# EAGLE design weather station shield (EAGLE 8.7.1)
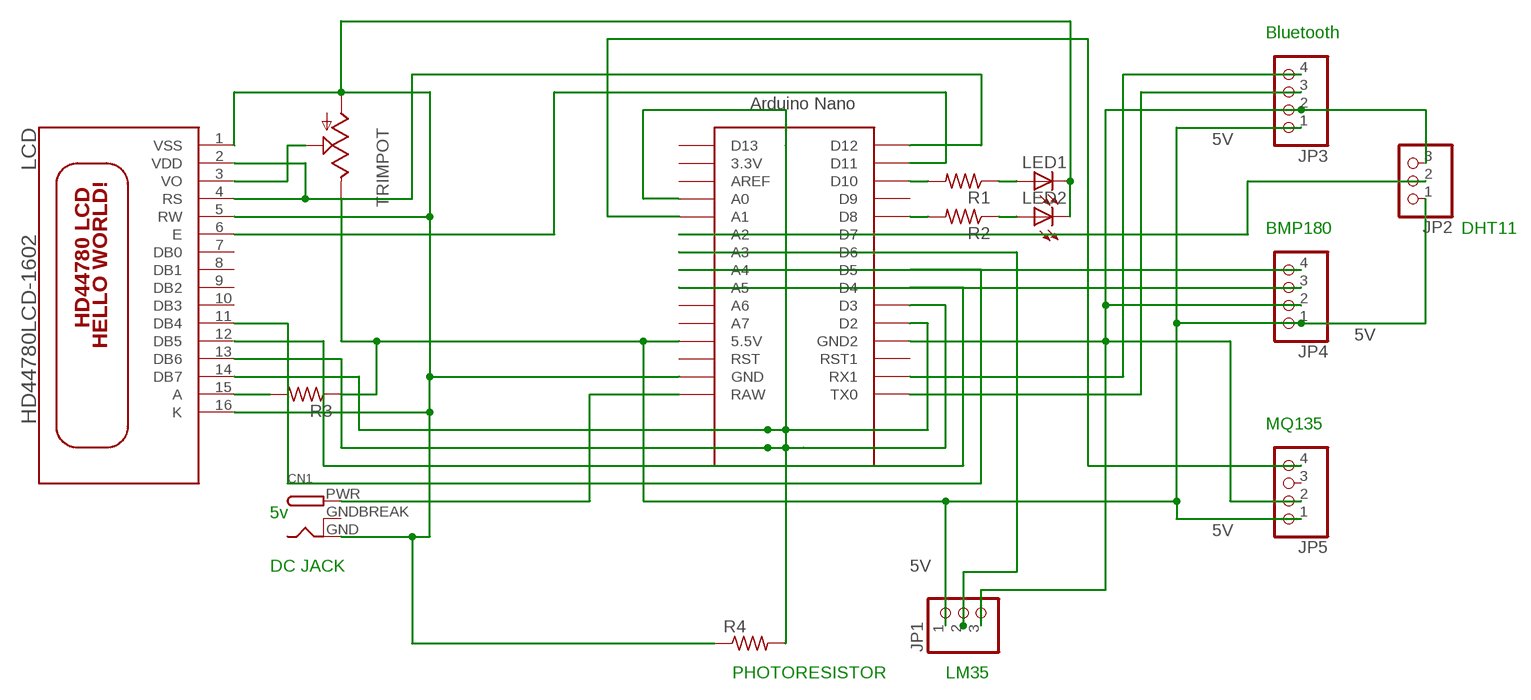
[diagram p0: schematic, sheet 1]

## Parts
CN1  DCBARRELPTH  [DCJACK_2MM_PTH]
JP1  PINHD-1X3  [1X03]
JP2  PINHD-1X3  [1X03]
JP3  PINHD-1X4  [1X04]
JP4  PINHD-1X4  [1X04]
JP5  PINHD-1X4  [1X04]
LCD  HD44780LCD-1602  [LCD1602]
LED1  LED5MM  [LED5MM]
LED2  LED5MM  [LED5MM]
R1  R-US_0204/7  [0204/7]
R2  R-US_0204/7  [0204/7]
R3  R-US_0204/7  [0204/7]
R4  R-US_0204/7  [0204/7]
TRIMPOT  TRIM_US-CA6V  [CA6V]
U$1  NANO  [NANO]

## Nets
5V: JP1.1 JP2.1 JP3.1 JP4.1 JP5.1 R3.1 TRIMPOT.E U$1.5V(5.5V)
N$1: LCD.13(DB6) U$1.D3 U$1.ICSP1 U$1.ICSP3 U$1.ICSP5
N$2: LCD.12(DB5) U$1.D4
N$3: LCD.3(VO) TRIMPOT.S
N$4: JP2.2 U$1.A2
N$5: LCD.6(E) U$1.D11
N$6: LCD.15(A) R3.2
N$7: LCD.11(DB4) U$1.D5
N$8: JP3.4 U$1.RX1
N$9: JP3.3 U$1.TX0
N$10: JP4.4 U$1.A4
N$11: JP4.3 U$1.A5
N$12: R1.2 U$1.D10
N$13: LED1.A R1.1
N$14: R2.2 U$1.D8
N$15: LED2.A R2.1
N$16: R4.2 U$1.A0
N$17: JP1.3 JP2.3 JP3.2 JP4.2 JP5.2 U$1.GND1(GND2)
N$18: JP5.4 U$1.A1
N$19: LCD.14(DB7) U$1.D2 U$1.ICSP2 U$1.ICSP4 U$1.ICSP6
N$22: JP1.2 U$1.A3
N$23: CN1.PWR U$1.RAW
VDD: LCD.2(VDD) LCD.4(RS) U$1.D12
VSS: CN1.GND LCD.1(VSS) LCD.5(RW) LCD.16(K) LED1.K(C) LED2.K(C) R4.1 TRIMPOT.A U$1.GND
Unconnected: JP5.3 LCD.7(DB0) LCD.8(DB1) LCD.9(DB2) LCD.10(DB3) U$1.3.3V U$1.A6 U$1.A7 U$1.AREF U$1.D6 U$1.D7 U$1.D9 U$1.D13 U$1.RST U$1.RST1

## Notes on the sheet
- Bluetooth
- BMP180 | DHT11
- MQ135
- 5v
- DC JACK
- PHOTORESISTOR | LM35

## Power pins joined to a net without a drawn wire
GNDBREAK: CN1.GNDBREAK

## Library data of the parts
CN1 = adafruit:DCBARREL: 2.0mm DC Barrel Jack DCJACK_2MM_PTH - Through Hole Jack (4UConnector: 05537)
JP1 JP2 = pinhead:PINHD-1X3: PIN HEADER
JP3-JP5 = pinhead:PINHD-1X4: PIN HEADER
LCD = adafruit:HD44780LCD: HD44780 LCD Standard character type LCDs, available in sizes from 8x1 to 40x4!
LED1 LED2 = adafruit:LED: LED OSRAM: - CHIPLED LG R971, LG N971, LY N971, LG Q971, LY Q971, LO R971, LY R971 LH N974, LH R974 LS Q976, LO Q976, LY Q976 LO Q996 - Hyper CHIPLED LW Q18S LB Q993, LB Q99A, LB R99A - SideLED LS A670, LO A670, LY A670, LG A670, LP A670 LB A673, LV A673, LT A673, LW A673 LH A674 LY A675 LS A676, LA A676, LO A676, LY A676, LW A676 LS A679, LY A679, LG A679 - Hyper Micro SIDELED® LS Y876, LA Y876, LO Y876, LY Y876 LT Y87S - SmartLED LW L88C, LW L88S LB L89C, LB L89S, LG L890 LS L89K, LO L89K, LY L89K LS L896, LA L896, LO L896, LY L896 - TOPLED LS T670, LO T670, LY T670, LG T670, LP T670 LSG T670, LSP T670, LSY T670, LOP T670, LYG T670 LG T671, LOG T671, LSG T671 LB T673, LV T673, LT T673, LW T673 LH T674 LS T676, LA T676, LO T676, LY T676, LB T676, LH T676, LSB T676, LW T676 LB T67C, LV T67C, LT T67C, LS T67K, LO T67K, LY T67K, LW E67C LS E67B, LA E67B, LO E67B, LY E67B, LB E67C, LV E67C, LT E67C LW T67C LS T679, LY T679, LG T679 LS T770, LO T770, LY T770, LG T770, LP T770 LB T773, LV T773, LT T773, LW T773 LH T774 LS E675, LA E675, LY E675, LS T675 LS T776, LA T776, LO T776, LY T776, LB T776 LHGB T686 LT T68C, LB T68C - Hyper Mini TOPLED® LB M676 - Mini TOPLED Santana® LG M470 LS M47K, LO M47K, LY M47K Source: http://www.osram.convergy.de/
R1-R4 = adafruit:R-US_: RESISTOR, American symbol
TRIMPOT = pot:TRIM_US-: POTENTIOMETER
U$1 = Arduino-clone:NANO: Arduino Nano

## Board
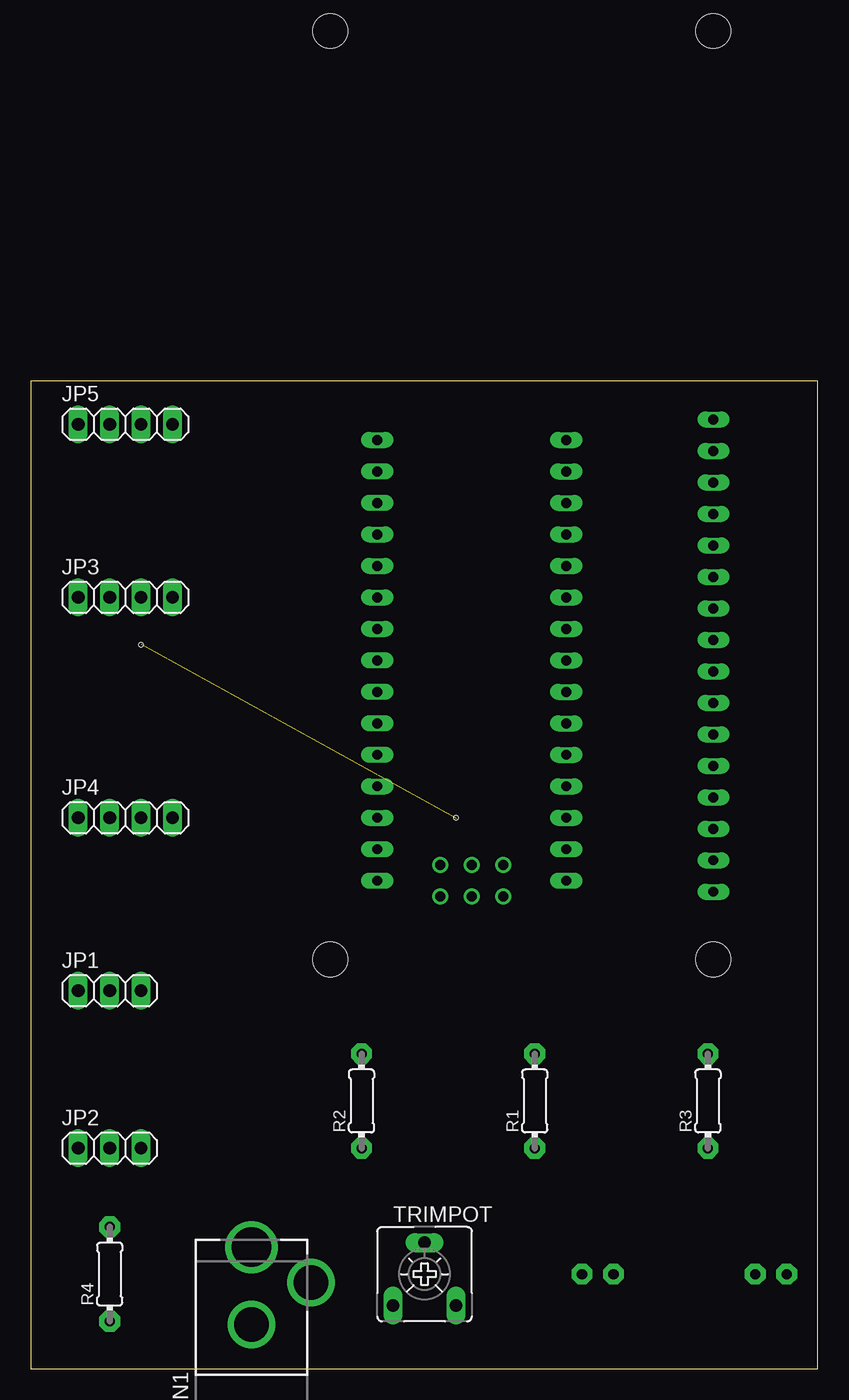
[diagram p1: board, top side]
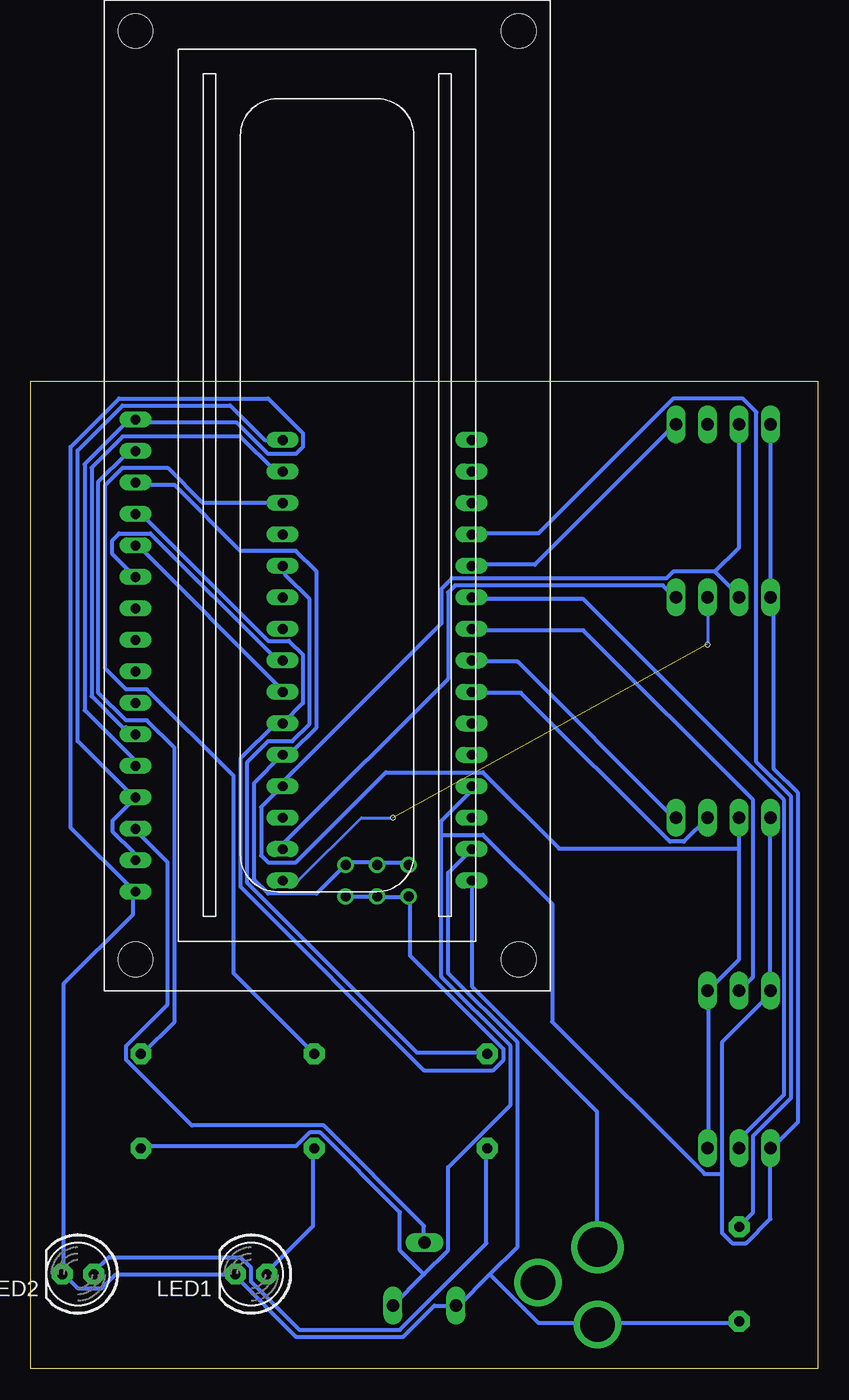
[diagram p2: board, bottom side, seen from below]

Size 63.48 x 79.68 mm. Coordinates in mm from the lower left corner, seen from the top.
Outline: 0,0 63.48,0 63.48,79.68 0,79.68 0,0
Copper layers (1*16): Top 0.035mm / dielectric 1.5mm / Bottom 0.035mm
Design rules "default *": minimum track width 12mil, minimum drill 0.35mm, track to track 10mil, track to pad 6mil, pad to pad 6mil, via to via 6mil, smd to smd 6mil, copper to edge 40mil, drill to drill 6mil, minimum pad ring 10mil, minimum via ring 8mil, stop-mask expansion 4mil, vias tented up to drill 0mil, thermal gap 10mil
Holes 0.35 mm at 8.89,58.42 34.29,44.45

### Footprints (pad centres in the part's own frame; a part is rotated, then mirrored left to right if it is on the bottom)
DCJACK_2MM_PTH = drill 2.8: GND 0,7.35; GNDBREAK 4.8,10.75 | drill 3.2: PWR 0,13.6
1X03 = drill 1.016 long: 1 -2.54,0; 2 0,0; 3 2.54,0
1X04 = drill 1.016 long: 1 -3.81,0; 2 -1.27,0; 3 1.27,0; 4 3.81,0
LCD1602 = drill 0.8 long: 1 8,33.46; 2 10.54,33.46; 3 13.08,33.46; 4 15.62,33.46; 5 18.16,33.46; 6 20.7,33.46; 7 23.24,33.46; 8 25.78,33.46; 9 28.32,33.46; 10 30.86,33.46; 11 33.4,33.46; 12 35.94,33.46; 13 38.48,33.46; 14 41.02,33.46; 15 43.56,33.46; 16 46.1,33.46 | hole 2.8: 2.54,2.54; 2.54,33.46; 77.46,33.46; 77.46,2.54
LED5MM = drill 0.813 pad 1.676 octagon: A -1.27,0; K 1.27,0
0204/7 = drill 0.813 pad 1.676 octagon: 1 -3.81,0; 2 3.81,0
CA6V = drill 1.016 long: A -2.54,-2.54; E 2.54,-2.54; S 0,2.54
NANO = drill 0.8 long: 3.3V -10.16,24.13; 5V -10.16,-1.27; A0 -10.16,19.05; A1 -10.16,16.51; A2 -10.16,13.97; A3 -10.16,11.43; A4 -10.16,8.89; A5 -10.16,6.35; A6 -10.16,3.81; A7 -10.16,1.27; AREF -10.16,21.59; D2 5.08,1.27; D3 5.08,3.81; D4 5.08,6.35; D5 5.08,8.89; D6 5.08,11.43; D7 5.08,13.97; D8 5.08,16.51; D9 5.08,19.05; D10 5.08,21.59; D11 5.08,24.13; D12 5.08,26.67; D13 -10.16,26.67; GND -10.16,-6.35; GND1 5.08,-1.27; RAW -10.16,-8.89; RST -10.16,-3.81; RST1 5.08,-3.81; RX1 5.08,-6.35; TX0 5.08,-8.89 | drill 0.8: ICSP1 -5.08,-10.16; ICSP2 -5.08,-7.62; ICSP3 -2.54,-10.16; ICSP4 -2.54,-7.62; ICSP5 0,-10.16; ICSP6 0,-7.62

### Placement (x,y rotation side)
CN1  17.78,-3.81 0 top
JP1  6.35,30.48 0 top
JP2  6.35,17.78 0 top
JP3  7.62,62.23 0 top
JP4  7.62,44.45 0 top
JP5  7.62,76.2 0 top
LCD  21.59,30.48 90 bottom
LED1  45.72,7.62 180 bottom
LED2  59.69,7.62 180 bottom
R1  40.64,21.59 90 top
R2  26.67,21.59 90 top
R3  54.61,21.59 90 top
R4  6.35,7.62 90 top
TRIMPOT  31.75,7.62 0 top
U$1  38.1,48.26 0 top

### Tracks (layer width: path | path; a pad name or v marks a point on that pad's centre or on a via)
5V
  Bottom 0.305: JP5.1 3.84,76.05 3.84,62.36 JP3.1 3.56,62.08 3.56,48.39 1.6,46.43 1.6,19.89 3.56,17.93 JP2.1 3.84,17.65 3.84,12.06 5.79,10.11 6.91,10.11 7.75,10.95 7.75,15.7 | 7.75,15.7 7.75,26.31 3.84,30.23 JP1.1 3.84,30.51 3.84,44.2 JP4.1 | 30.38,43.08 30.38,31.62 24.79,26.04 24.79,21.29 29.82,16.26 29.82,9.55 31.78,7.59 | 30.38,43.08 30.38,44.2 28.14,46.43 28.14,46.99 U$1.5V | TRIMPOT.E 31.78,7.59 | 31.78,7.59 33.73,9.55 33.73,12.62 40.16,19.05 41,19.05 42.11,17.93 54.41,17.93 R3.1 | 7.75,15.7 9.14,15.7 21.44,27.99 21.44,37.49 27.03,43.08 30.38,43.08
N$1
  Bottom 0.305: U$1.ICSP5 37.92,38.05 35.69,38.05 U$1.ICSP3 35.41,38.05 33.17,38.05 U$1.ICSP1 32.89,38.05 32.89,33.3 25.35,25.76 25.35,24.92 26.19,24.08 31.78,24.08 46.58,38.89 46.58,49.22 43.79,52.02 43.23,52.02 U$1.D3 41.55,53.7 41.55,57.61 42.67,58.72 44.35,58.72 54.41,68.78 54.97,68.78 LCD.13
N$2
  Bottom 0.305: U$1.D4 43.23,54.81 54.97,66.55 LCD.12
N$3
  Bottom 0.305: LCD.3 54.97,43.36 52.45,40.84 52.45,29.39 55.8,26.04 55.8,24.92 50.49,19.61 39.88,19.61 31.78,11.51 31.78,10.39 TRIMPOT.S
N$4
  Bottom 0.305: JP2.2 6.35,18.49 2.72,22.12 2.72,45.87 18.92,62.08 27.86,62.08 U$1.A2
N$5
  Bottom 0.305: LCD.6 55.24,51.18 55.8,51.74 56.08,51.74 58.6,54.25 58.6,72.7 56.08,75.21 46.58,75.21 43.79,72.42 43.23,72.42 U$1.D11
N$6
  Bottom 0.305: LCD.15 55.24,73.81 55.8,73.81 58.04,71.58 58.04,54.53 55.8,52.3 54.13,52.3 51.89,50.06 51.89,27.99 54.41,25.48 R3.2
N$7
  Bottom 0.305: U$1.D5 43.23,57.33 43.79,57.33 53.85,67.39 56.36,67.39 56.92,66.83 56.92,65.71 55.24,64.03 LCD.11
N$8
  Bottom 0.305: U$1.RX1 42.95,41.96 42.95,42.52 29.82,55.65 29.82,62.64 29.26,63.2 12.5,63.2 11.66,62.36 JP3.4
N$9  (1 unrouted)
  Bottom 0.254: JP3.3 8.89,58.47 | U$1.TX0 41.91,39.37 36.83,44.45 34.29,44.45
N$10
  Bottom 0.305: U$1.A4 27.86,57.05 24.23,57.05 11.66,44.47 JP4.4
N$11
  Bottom 0.305: JP4.3 10.82,42.52 11.94,42.52 23.95,54.53 27.86,54.53 U$1.A5
N$12
  Bottom 0.305: R1.2 47.14,31.9 47.14,47.83 54.13,54.81 55.8,54.81 57.48,56.49 57.48,71.3 56.08,72.7 52.45,72.7 49.66,69.9 43.23,69.9 U$1.D10
N$13
  Bottom 0.305: R1.1 40.72,17.65 40.72,11.51 44.35,7.87 LED1.A
N$14  (via drill 0.35)
  Top 0.305: v26.75,25.48 R2.2
  Bottom 0.305: v26.75,25.48 32.33,25.48 46.02,39.17 46.02,48.95 44.35,50.62 42.39,50.62 41,52.02 41,62.08 42.95,64.03 42.95,64.59 U$1.D8
N$15  (via drill 0.35)
  Top 0.305: v26.75,17.65 R2.1
  Bottom 0.305: v26.75,17.65 26.75,10.11 33.73,3.12 41.83,3.12 45.74,7.04 45.74,8.15 46.58,8.99 57.2,8.99 58.32,7.87 LED2.A
N$16
  Bottom 0.305: U$1.A0 27.86,67.39 22.56,67.39 11.66,78.28 6.07,78.28 4.95,77.17 4.95,48.95 2.16,46.15 2.16,21.84 5.23,18.77 5.23,12.62 6.35,11.51 R4.2
N$17
  Bottom 0.305: 6.35,41.96 6.35,33.02 JP1.3 8.86,30.23 8.86,17.93 JP2.3 | 6.35,41.96 JP4.2 | 8.31,64.31 11.66,64.31 12.22,63.75 29.54,63.75 30.38,62.92 30.38,60.12 42.95,47.55 42.95,46.99 U$1.GND1 43.23,46.99 44.91,45.31 44.91,41.4 44.35,40.84 42.11,40.84 34.85,48.11 27.03,48.11 20.88,41.96 6.35,41.96 | 8.31,64.31 6.35,62.36 JP3.2 | JP5.2 6.35,66.27 8.31,64.31
N$18
  Bottom 0.305: U$1.A1 27.86,64.87 22.83,64.87 11.66,76.05 JP5.4
N$19
  Bottom 0.305: U$1.ICSP2 33.17,40.84 35.41,40.84 U$1.ICSP4 35.69,40.84 37.92,40.84 U$1.ICSP6 38.2,40.56 40.44,38.33 44.35,38.33 45.47,39.45 45.47,47.27 43.23,49.5 U$1.D2 42.95,49.78 42.39,49.78 40.44,51.74 40.44,64.31 42.11,65.99 46.58,65.99 51.89,71.3 54.97,71.3 LCD.14
N$22
  Bottom 0.305: U$1.A3 27.86,59.56 18.92,59.56 5.23,45.87 5.23,31.62 6.35,30.51 JP1.2
N$23
  Bottom 0.305: U$1.RAW 27.86,39.17 27.86,30.79 17.81,20.73 17.81,9.83 CN1.PWR
VDD
  Bottom 0.305: LCD.2 55.24,41.12 55.24,41.68 56.92,43.36 56.92,44.2 55.24,45.87 LCD.4 55.24,46.15 59.72,50.62 59.72,74.09 56.08,77.72 47.42,77.72 44.63,74.93 U$1.D12
VSS
  Bottom 0.305: R4.1 6.35,3.68 17.53,3.68 CN1.GND 17.81,3.68 22.56,3.68 26.47,7.59 | 26.47,7.59 28.98,5.08 TRIMPOT.A 30.94,5.08 33.45,2.57 42.11,2.57 47.14,7.59 | 26.47,7.59 24.23,9.83 24.23,26.31 29.82,31.9 29.82,40.01 28.14,41.68 U$1.GND | LCD.5 55.24,48.67 55.24,49.22 59.16,53.14 59.16,72.97 55.8,76.33 55.24,76.33 LCD.16 54.97,76.33 46.86,76.33 44.35,73.81 42.11,73.81 41.55,74.37 41.55,75.49 44.35,78.28 56.36,78.28 60.27,74.37 60.27,43.64 55.24,38.61 LCD.1 55.24,38.33 55.24,36.65 60.83,31.06 60.83,7.87 LED2.K 60.83,7.59 59.72,6.48 57.76,6.48 56.64,7.59 47.14,7.59 | 47.14,7.59 LED1.K